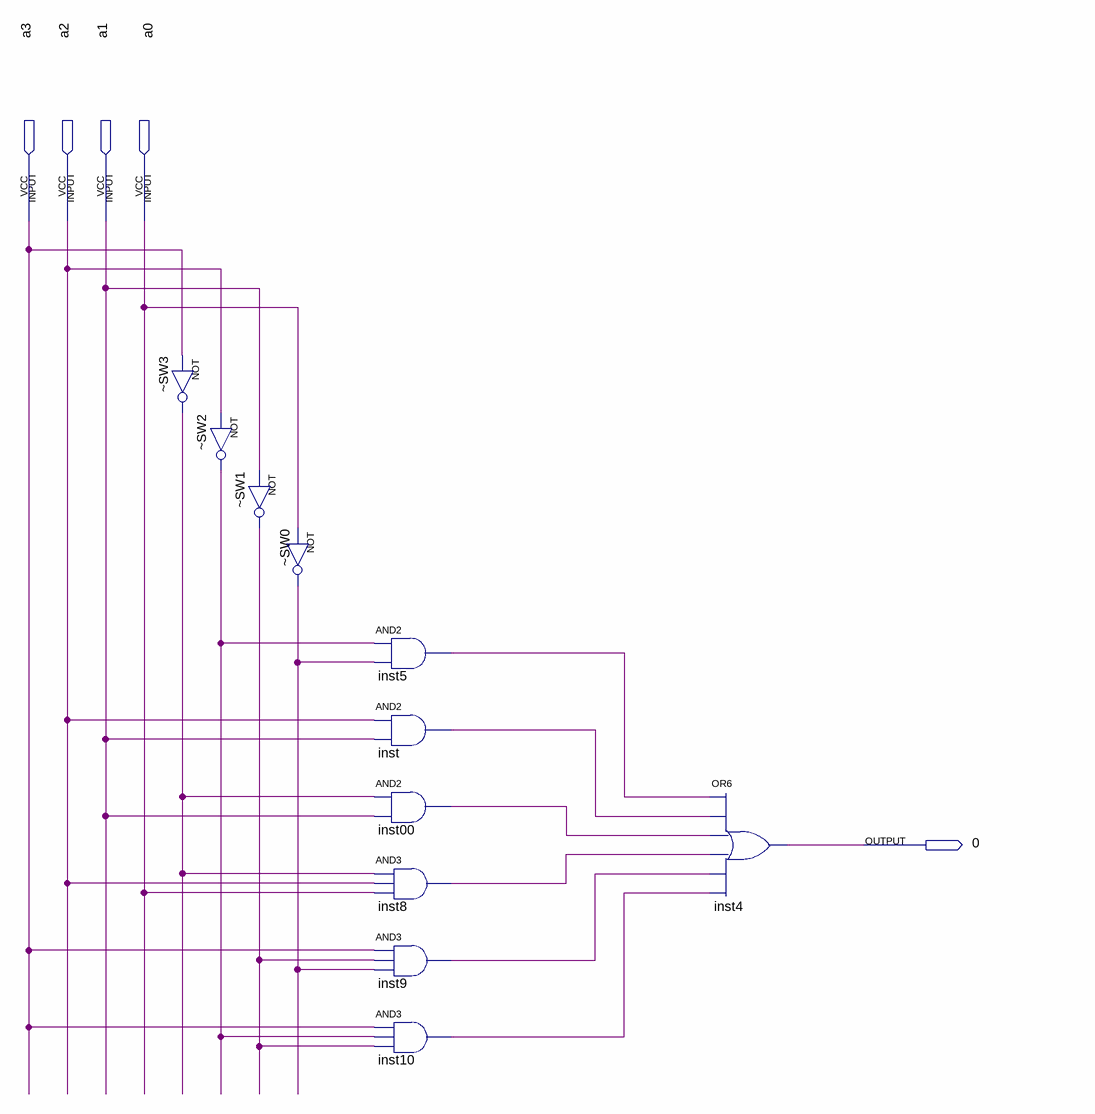
[diagram p0: schematic sheet]
// Quartus schematic 0.bdf as structural Verilog: 11 symbols, 5 pins
module \0  (
  input  a3,
  input  a2,
  input  a1,
  input  a0,
  output \0 
);

  wire _SW0_out, _SW1_out, _SW2_out, _SW3_out, inst00_out, inst5_out, inst8_out, inst9_out, inst10_out,
       inst_out;

  not \u_~SW3  (_SW3_out, a3);
  not \u_~SW2  (_SW2_out, a2);
  not \u_~SW1  (_SW1_out, a1);
  not \u_~SW0  (_SW0_out, a0);
  and inst5 (inst5_out, _SW2_out, _SW0_out);
  and inst (inst_out, a2, a1);
  and inst00 (inst00_out, _SW3_out, a1);
  and inst8 (inst8_out, _SW3_out, a2, a0);
  and inst9 (inst9_out, a3, _SW1_out, _SW0_out);
  and inst10 (inst10_out, a3, _SW2_out, _SW1_out);
  or inst4 (\0 , inst5_out, inst_out, inst00_out, inst8_out, inst9_out, inst10_out);
endmodule
